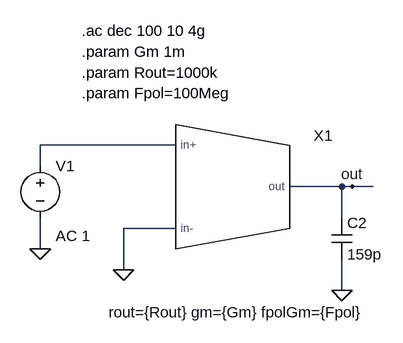
[diagram p0: schematic tb_LosslessIntegr_Gm_model.asc]
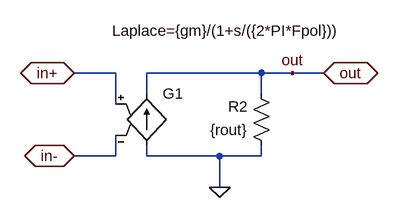
[diagram p1: sub-circuit gm_model.asc]
tb_LosslessIntegr_Gm_model.asc, the LTspice schematic file:
Version 4
SHEET 1 2700 1708
WIRE -32 224 -240 224
WIRE -240 256 -240 224
WIRE 224 288 144 288
WIRE 240 288 224 288
WIRE 272 288 240 288
WIRE 224 336 224 288
WIRE -32 352 -112 352
WIRE -240 384 -240 336
WIRE -112 416 -112 352
WIRE 224 448 224 400
FLAG -240 384 0
FLAG 240 288 out
FLAG 224 448 0
FLAG -112 416 0
SYMBOL voltage -240 240 R0
WINDOW 123 24 124 Left 2
WINDOW 39 0 0 Left 2
SYMATTR Value2 AC 1
SYMATTR InstName V1
SYMATTR Value ""
SYMBOL cap 208 336 R0
SYMATTR InstName C2
SYMATTR Value 159p
SYMBOL Gm_model 192 272 R0
WINDOW 39 -128 225 Bottom 2
SYMATTR InstName X1
SYMATTR SpiceLine rout={Rout} gm={Gm} fpolGm={Fpol}
TEXT -176 48 Left 2 !.ac dec 100 10 4g
TEXT -176 80 Left 2 !.param Gm 1m
TEXT -176 112 Left 2 !.param Rout=1000k
TEXT -176 144 Left 2 !.param Fpol=100Meg

gm_model.asc, the sub-circuit schematic file:
Version 4
SHEET 1 2564 1736
WIRE 1248 208 1184 208
WIRE 1472 208 1296 208
WIRE 1520 208 1472 208
WIRE 1568 208 1520 208
WIRE 1296 240 1296 208
WIRE 1472 240 1472 208
WIRE 1248 256 1248 208
WIRE 1248 336 1248 304
WIRE 1248 336 1184 336
WIRE 1296 336 1296 320
WIRE 1408 336 1296 336
WIRE 1472 336 1472 320
WIRE 1472 336 1408 336
WIRE 1408 384 1408 336
FLAG 1520 208 out
FLAG 1568 208 out
IOPIN 1568 208 BiDir
FLAG 1184 208 in+
IOPIN 1184 208 BiDir
FLAG 1184 336 in-
IOPIN 1184 336 BiDir
FLAG 1408 384 0
SYMBOL g 1296 224 R0
WINDOW 3 -53 -81 Left 2
SYMATTR Value Laplace={gm}/(1+s/({2*PI*Fpol}))
SYMATTR InstName G1
SYMBOL res 1488 336 R180
WINDOW 0 36 76 Left 2
WINDOW 3 36 40 Left 2
SYMATTR InstName R2
SYMATTR Value {rout}

The netlist it stands for:
* tb_LosslessIntegr_Gm_model.asc
V1 N001 0 AC 1
C2 out 0 159p
XX1 N001 0 out gm_model params: rout={Rout} gm={Gm} fpolGm={Fpol}

* block symbol definitions
.subckt gm_model in+ in- out
G1 0 out in+ in- Laplace={gm}/(1+s/({2*PI*Fpol}))
R2 0 out {rout}
.ends gm_model

.ac dec 100 10 4g
.param Gm 1m
.param Rout=1000k
.param Fpol=100Meg
.backanno
.end